# Altium schematic sheet U-F-M5DS-Y-7_2021-12-13.schdoc
size 49 x 48 mm
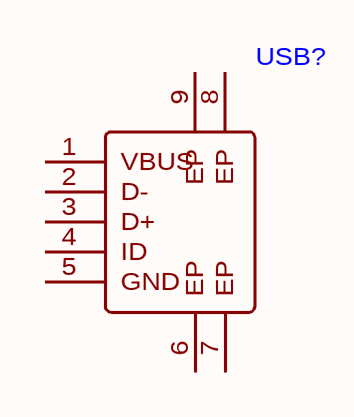
[diagram p0: U-F-M5DS-Y-7_2021-12-13.schdoc]

## Parts
USB?  (no value)  [MICRO-USB-SMD_MICRO-USB-A7]

## Nets

Not connected (* = marked no-connect by the designer): USB? 1(VBUS) 2(D-) 3(D+) 4(ID) 5(GND) 6(EP) 7(EP) 8(EP) 9(EP)

## Library data of the parts
USB? = U-F-M5DS-Y-7